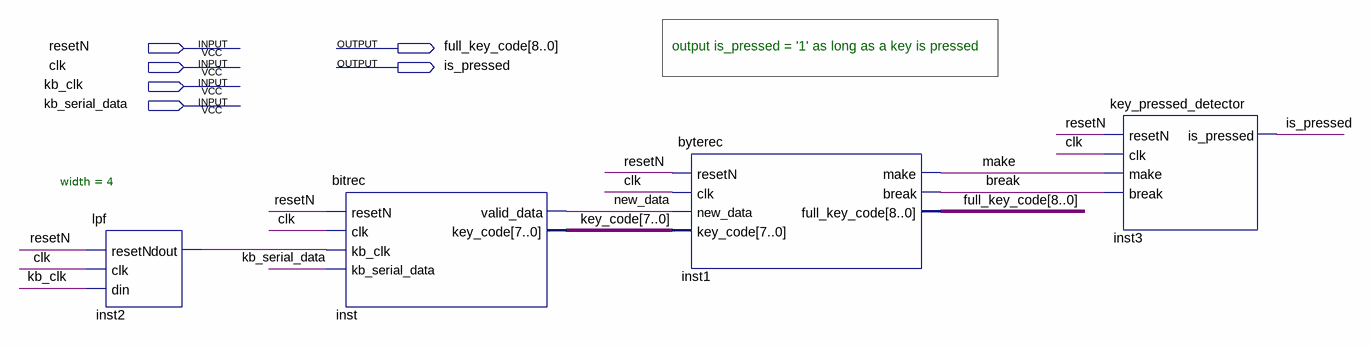
[diagram p0: schematic sheet]
// Quartus schematic keyboard.bdf as structural Verilog: 4 symbols, 6 pins
module keyboard (
  input  resetN,
  input  clk,
  input  kb_clk,
  input  kb_serial_data,
  output [8:0] full_key_code,
  output is_pressed
);

  wire \break , inst2_dout, make, new_data;
  wire [7:0] key_code;

  lpf #(.width(4)) inst2 (.resetN(resetN), .clk(clk), .din(kb_clk), .dout(inst2_dout));
  bitrec inst (
    .resetN(resetN), .clk(clk), .kb_clk(inst2_dout), .kb_serial_data(kb_serial_data), .valid_data(new_data),
    .key_code(key_code));
  byterec inst1 (
    .resetN(resetN), .clk(clk), .new_data(new_data), .key_code(key_code), .make(make), .\break (\break ),
    .full_key_code(full_key_code));
  key_pressed_detector inst3 (.resetN(resetN), .clk(clk), .make(make), .\break (\break ), .is_pressed(is_pressed));

  // Notes on the sheet:
  //   output is_pressed = '1' as long as a key is pressed
endmodule
